# Altium schematic sheet Requirments.SchDoc
size A4
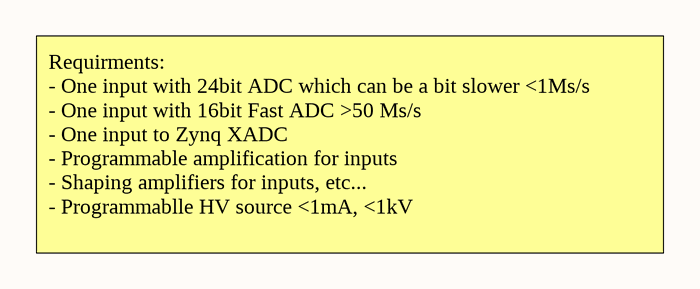
[diagram p0: Requirments.SchDoc]

## Notes on the sheet
- Requirments:
  - One input with 24bit ADC which can be a bit slower <1Ms/s
  - One input with 16bit Fast ADC >50 Ms/s
  - One input to Zynq XADC
  - Programmable amplification for inputs
  - Shaping amplifiers for inputs, etc...
  - Programmablle HV source <1mA, <1kV